# Altium schematic sheet pressure.SchDoc
size A4; SheetNumber: 6; SheetTotal: 6
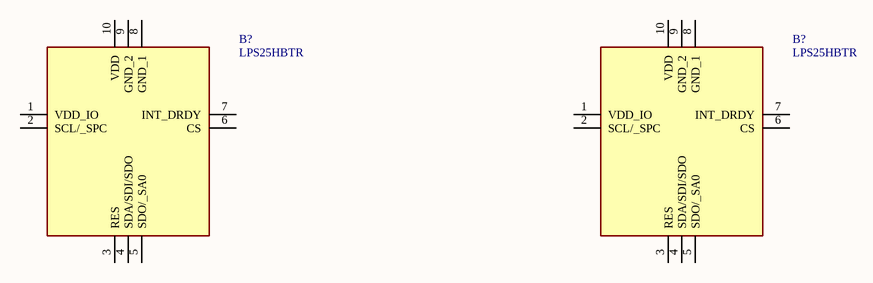
[diagram p0: pressure.SchDoc]

## Parts
(Parts that share a designator on the sheet are numbered #1, #2 ... from top to bottom, then left to right.)
B?#1  LPS25HBTR  [LPS25HBTR]
B?#2  LPS25HBTR  [LPS25HBTR]

## Nets

Not connected (* = marked no-connect by the designer): B?#1 1(VDD_IO) 2(SCL/_SPC) 3(RES) 4(SDA/SDI/SDO) 5(SDO/_SA0) 6(CS) 7(INT_DRDY) 8(GND_1) 9(GND_2) 10(VDD); B?#2 1(VDD_IO) 2(SCL/_SPC) 3(RES) 4(SDA/SDI/SDO) 5(SDO/_SA0) 6(CS) 7(INT_DRDY) 8(GND_1) 9(GND_2) 10(VDD)

## Library data of the parts
B?#1 B?#2 = LPS25HBTR: Board Mount Pressure Sensor 26kPa to 126kPa Absolute 10-Pin HLGA T/R; Manufacturer_Name: STMicroelectronics; Geometry.Height: 0.8mm; Mouser Part Number: 511-LPS25HBTR; Mouser Price/Stock: https://www.mouser.co.uk/ProductDetail/STMicroelectronics/LPS25HBTR?qs=GDOUxV2YAh9IvjPyBKWGzQ%3D%3D; Manufacturer_Part_Number: LPS25HBTR; Datasheet Link: https://www.st.com/resource/en/datasheet/lps25hb.pdf